# Altium schematic sheet bolid-inputs-hv.SchDoc
size A3
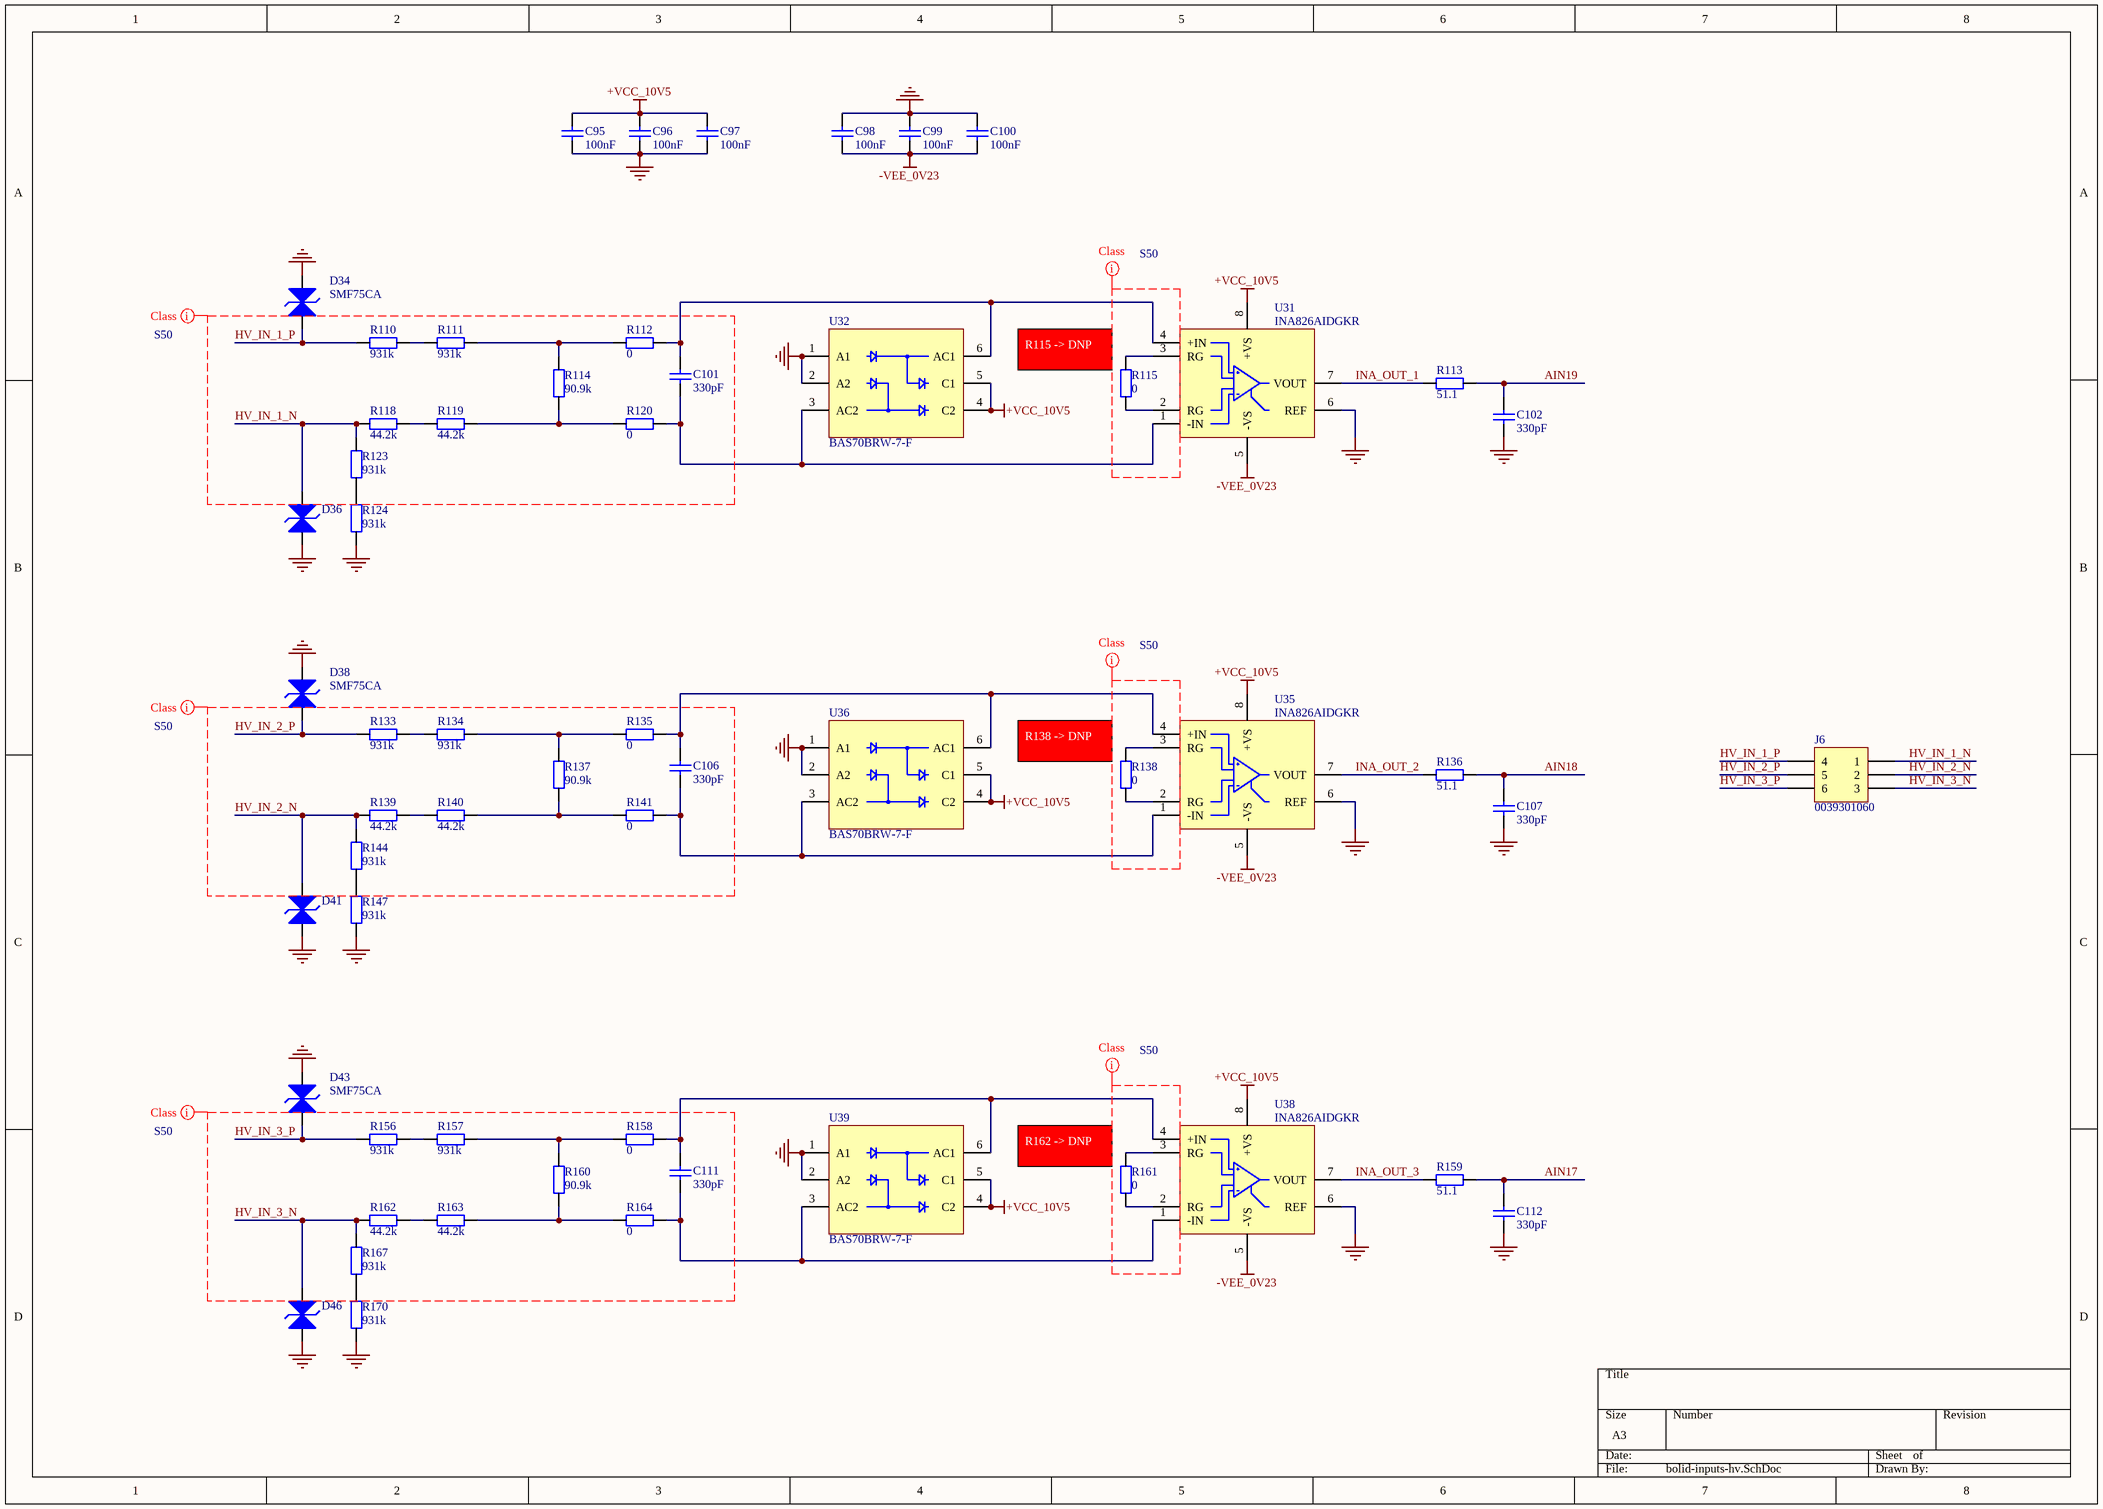
[diagram p0: bolid-inputs-hv.SchDoc]

## Parts
C95  Value Displayed: 100nF  [C0402-CAPC100X50X55L22 - Tayio Yuden TDK]  (hidden comment: GRM155R71H104KE14D)
C96  Value Displayed: 100nF  [C0402-CAPC100X50X55L22 - Tayio Yuden TDK]  (hidden comment: GRM155R71H104KE14D)
C97  Value Displayed: 100nF  [C0402-CAPC100X50X55L22 - Tayio Yuden TDK]  (hidden comment: GRM155R71H104KE14D)
C98  Value Displayed: 100nF  [C0402-CAPC100X50X55L22 - Tayio Yuden TDK]  (hidden comment: GRM155R71H104KE14D)
C99  Value Displayed: 100nF  [C0402-CAPC100X50X55L22 - Tayio Yuden TDK]  (hidden comment: GRM155R71H104KE14D)
C100  Value Displayed: 100nF  [C0402-CAPC100X50X55L22 - Tayio Yuden TDK]  (hidden comment: GRM155R71H104KE14D)
C101  Value Displayed: 330pF  [C0402-CAPC100X50X55L22 - Tayio Yuden TDK]  (hidden comment: C0402C331J5GAC)
C102  Value Displayed: 330pF  [C0402-CAPC100X50X55L22 - Tayio Yuden TDK]  (hidden comment: C0402C331J5GAC)
C106  Value Displayed: 330pF  [C0402-CAPC100X50X55L22 - Tayio Yuden TDK]  (hidden comment: C0402C331J5GAC)
C107  Value Displayed: 330pF  [C0402-CAPC100X50X55L22 - Tayio Yuden TDK]  (hidden comment: C0402C331J5GAC)
C111  Value Displayed: 330pF  [C0402-CAPC100X50X55L22 - Tayio Yuden TDK]  (hidden comment: C0402C331J5GAC)
C112  Value Displayed: 330pF  [C0402-CAPC100X50X55L22 - Tayio Yuden TDK]  (hidden comment: C0402C331J5GAC)
D34  SMF75CA  [SOD-123FL SODFL365X110-2N - BIDIRECTIONAL - Littelfuse]
D36  SMF75CA  [SOD-123FL SODFL365X110-2N - BIDIRECTIONAL - Littelfuse]  (value not drawn)
D38  SMF75CA  [SOD-123FL SODFL365X110-2N - BIDIRECTIONAL - Littelfuse]
D41  SMF75CA  [SOD-123FL SODFL365X110-2N - BIDIRECTIONAL - Littelfuse]  (value not drawn)
D43  SMF75CA  [SOD-123FL SODFL365X110-2N - BIDIRECTIONAL - Littelfuse]
D46  SMF75CA  [SOD-123FL SODFL365X110-2N - BIDIRECTIONAL - Littelfuse]  (value not drawn)
J6  0039301060  [MOLEX Mini-Fit Jr 039301060 2x3 PEG]
R110  value 931k  [R0603-RESC160X80X55L30N]  (hidden comment: RC0603FR-07931KL)
R111  value 931k  [R0603-RESC160X80X55L30N]  (hidden comment: RC0603FR-07931KL)
R112  value 0  [R0402-RESC100X50X40L22N]  (hidden comment: RC0402JR-7D0RL)
R113  value 51.1  [R0402-RESC100X50X40L22N]  (hidden comment: AC0402FR-0751R1L)
R114  value 90.9k  [R0402-RESC100X50X40L22N]  (hidden comment: RC0402FR-0790K9L)
R115  value 0  [R0402-RESC100X50X40L22N]  (hidden comment: RC0402JR-7D0RL)
R118  value 44.2k  [R0603-RESC160X80X55L30N]  (hidden comment: RC0603FR-0744K2L)
R119  value 44.2k  [R0603-RESC160X80X55L30N]  (hidden comment: RC0603FR-0744K2L)
R120  value 0  [R0402-RESC100X50X40L22N]  (hidden comment: RC0402JR-7D0RL)
R123  value 931k  [R0603-RESC160X80X55L30N]  (hidden comment: RC0603FR-07931KL)
R124  value 931k  [R0603-RESC160X80X55L30N]  (hidden comment: RC0603FR-07931KL)
R133  value 931k  [R0603-RESC160X80X55L30N]  (hidden comment: RC0603FR-07931KL)
R134  value 931k  [R0603-RESC160X80X55L30N]  (hidden comment: RC0603FR-07931KL)
R135  value 0  [R0402-RESC100X50X40L22N]  (hidden comment: RC0402JR-7D0RL)
R136  value 51.1  [R0402-RESC100X50X40L22N]  (hidden comment: AC0402FR-0751R1L)
R137  value 90.9k  [R0402-RESC100X50X40L22N]  (hidden comment: RC0402FR-0790K9L)
R138  value 0  [R0402-RESC100X50X40L22N]  (hidden comment: RC0402JR-7D0RL)
R139  value 44.2k  [R0603-RESC160X80X55L30N]  (hidden comment: RC0603FR-0744K2L)
R140  value 44.2k  [R0603-RESC160X80X55L30N]  (hidden comment: RC0603FR-0744K2L)
R141  value 0  [R0402-RESC100X50X40L22N]  (hidden comment: RC0402JR-7D0RL)
R144  value 931k  [R0603-RESC160X80X55L30N]  (hidden comment: RC0603FR-07931KL)
R147  value 931k  [R0603-RESC160X80X55L30N]  (hidden comment: RC0603FR-07931KL)
R156  value 931k  [R0603-RESC160X80X55L30N]  (hidden comment: RC0603FR-07931KL)
R157  value 931k  [R0603-RESC160X80X55L30N]  (hidden comment: RC0603FR-07931KL)
R158  value 0  [R0402-RESC100X50X40L22N]  (hidden comment: RC0402JR-7D0RL)
R159  value 51.1  [R0402-RESC100X50X40L22N]  (hidden comment: AC0402FR-0751R1L)
R160  value 90.9k  [R0402-RESC100X50X40L22N]  (hidden comment: RC0402FR-0790K9L)
R161  value 0  [R0402-RESC100X50X40L22N]  (hidden comment: RC0402JR-7D0RL)
R162  value 44.2k  [R0603-RESC160X80X55L30N]  (hidden comment: RC0603FR-0744K2L)
R163  value 44.2k  [R0603-RESC160X80X55L30N]  (hidden comment: RC0603FR-0744K2L)
R164  value 0  [R0402-RESC100X50X40L22N]  (hidden comment: RC0402JR-7D0RL)
R167  value 931k  [R0603-RESC160X80X55L30N]  (hidden comment: RC0603FR-07931KL)
R170  value 931k  [R0603-RESC160X80X55L30N]  (hidden comment: RC0603FR-07931KL)
U31  INA826AIDGKR  [TI VSSOP8 DGK0008A TSOP65P490X110-8N]
U32  BAS70BRW-7-F  [SOT363 DIODES DS30158 Rev. 14-2 SOT65P210X110-6N]
U35  INA826AIDGKR  [TI VSSOP8 DGK0008A TSOP65P490X110-8N]
U36  BAS70BRW-7-F  [SOT363 DIODES DS30158 Rev. 14-2 SOT65P210X110-6N]
U38  INA826AIDGKR  [TI VSSOP8 DGK0008A TSOP65P490X110-8N]
U39  BAS70BRW-7-F  [SOT363 DIODES DS30158 Rev. 14-2 SOT65P210X110-6N]

## Nets
+VCC_10V5: C95.2 C96.2 C97.2 U31.8(+VS) U32.4(C2) U32.5(C1) U35.8(+VS) U36.4(C2) U36.5(C1) U38.8(+VS) U39.4(C2) U39.5(C1)
-VEE_0V23: C98.1 C99.1 C100.1 U31.5(-VS) U35.5(-VS) U38.5(-VS)
GND: C95.1 C96.1 C97.1 C98.2 C99.2 C100.2 C102.1 C107.1 C112.1 D34.2 D36.1 D38.2 D41.1 D43.2 D46.1 R124.1 R147.1 R170.1 U31.6(REF) U32.1(A1) U32.2(A2) U35.6(REF) U36.1(A1) U36.2(A2) U38.6(REF) U39.1(A1) U39.2(A2)
AIN17: C112.2 R159.2
AIN18: C107.2 R136.2
AIN19: C102.2 R113.2
HV_IN_1_N: D36.2 J6.1 R118.1 R123.2
HV_IN_1_P: D34.1 J6.4 R110.1
HV_IN_2_N: D41.2 J6.2 R139.1 R144.2
HV_IN_2_P: D38.1 J6.5 R133.1
HV_IN_3_N: D46.2 J6.3 R162.1 R167.2
HV_IN_3_P: D43.1 J6.6 R156.1
INA_OUT_1: R113.1 U31.7(VOUT)
INA_OUT_2: R136.1 U35.7(VOUT)
INA_OUT_3: R159.1 U38.7(VOUT)
NetC101_1: C101.1 R120.1 U31.1(-IN) U32.3(AC2)
NetC101_2: C101.2 R112.1 U31.4(+IN) U32.6(AC1)
NetC106_1: C106.1 R141.1 U35.1(-IN) U36.3(AC2)
NetC106_2: C106.2 R135.1 U35.4(+IN) U36.6(AC1)
NetC111_1: C111.1 R164.1 U38.1(-IN) U39.3(AC2)
NetC111_2: C111.2 R158.1 U38.4(+IN) U39.6(AC1)
NetR110_2: R110.2 R111.1
NetR111_2: R111.2 R112.2 R114.2
NetR114_1: R114.1 R119.2 R120.2
NetR115_1: R115.1 U31.2(RG)
NetR115_2: R115.2 U31.3(RG)
NetR118_2: R118.2 R119.1
NetR123_1: R123.1 R124.2
NetR133_2: R133.2 R134.1
NetR134_2: R134.2 R135.2 R137.2
NetR137_1: R137.1 R140.2 R141.2
NetR138_1: R138.1 U35.2(RG)
NetR138_2: R138.2 U35.3(RG)
NetR139_2: R139.2 R140.1
NetR144_1: R144.1 R147.2
NetR156_2: R156.2 R157.1
NetR157_2: R157.2 R158.2 R160.2
NetR160_1: R160.1 R163.2 R164.2
NetR161_1: R161.1 U38.2(RG)
NetR161_2: R161.2 U38.3(RG)
NetR162_2: R162.2 R163.1
NetR167_1: R167.1 R170.2

## Layout directives
net class S50: (no net found under the mark), HV_IN_1_N, HV_IN_1_P, HV_IN_2_N, HV_IN_2_P, HV_IN_3_N, HV_IN_3_P

## Notes on the sheet
- (near R115) R115 -> DNP
- (near R138) R138 -> DNP
- (near R161) R162 -> DNP

## Library data of the parts
C95-C100 = GRM155R71H104KE14D: MLCC 0402 (1005) 100nF 10% 50V X7R; Manufacturer: Murata Electronics; Capacitance: 0.1 uF; Type: Chip Multilayer Ceramic Capacitor for General Purpose; Voltage Rating DC: 50 VDC; Capacitance - pF: 100000 pF; Class: Class 2; Supplier 1: Mouser; Manufacturer Part Number: GRM155R71H104KE14D; RoHS: RoHS Compliant; Category: Multilayer Ceramic Capacitors MLCC - SMD/SMT; Stock 1: 3511637; Pricing 1: 1=0.090, 10=0.038, 100=0.016, 500=0.012, 1000=0.009, 2500=0.008, 5000=0.007, 10000=0.005 (EUR); Height: 0.5 mm; Length: 1 mm; Package / Case: 0402 (1005 metric); Packaging: Cut Tape; Product: General Type MLCCs; Series: GRM; Termination Style: SMD/SMT; Tolerance: 10 %; Width: 0.5 mm; Brand: Murata Electronics; Capacitance - nF: 100 nF; Case Code - in: 0402; Case Code - mm: 1005; Dielectric: X7R; Maximum Operating Temperature: + 125 C; Minimum Operating Temperature: - 55 C; Product Type: Ceramic Capacitors; Standard Pack Qty: 10000; Subcategory: Capacitors; Termination: Standard; RoHS - Mouser: Y; Minimum Order Quantity: 1; Reeling: True; ComponentLink1URL: https://www.mouser.com/datasheet/2/281/murata_03052018_GRM_Series_1-1310166.pdf; ComponentLink1Description: https://www.mouser.com/datasheet/2/281/murata_03052018_GRM_Series_1-1310166.pdf; Value: 100nF; Supplier Part Number 1: 81-GRM155R71H104KE4D
C101 C102 C106 C107 C111 C112 = C0402C331J5GAC: MLCC 0402 (1005) 330pF 5% 50V C0G (N0P); Manufacturer: KEMET; Dielectric Material: Ceramic; Dissipation Factor: 0.1%; Value: 330p; Supplier 1: Mouser; Manufacturer Part Number: C0402C331J5GAC; RoHS: Yes; Category: Ceramic Capacitors; Stock 1: 30000; Pricing 1: 10000=0,08600 (USD); Case/Package: 0402; Case Code (Imperial): 0402; Case Code (Metric): 1005; Min Operating Temperature: -55°C; Max Operating Temperature: 125°C; Capacitance: 330pF; Voltage Rating (DC): 50V; Tolerance: 5%; Package Quantity: 10000; Voltage Rating: 50V; Packaging: Tape and Reel; Dielectric: C0G; Termination: SMD/SMT; Series: C0402C; Length: 1mm; Width: 0.5mm; Height: 0.5mm; Lead Free: Lead Free; RoHS Compliant: Yes; ComponentLink1URL: https://datasheet.ciiva.com/13387/kem-c1003-c0g-smd-356956-13387134.pdf?src-supplier=Mouser; ComponentLink1Description: https://datasheet.ciiva.com/13387/kem-c1003-c0g-smd-356956-13387134.pdf?src-supplier=Mouser; Supplier Part Number 1: 80-C0402C331J5GAC
D34 D36 D38 D41 D43 D46 = SMF75CA: Manufacturer: Littelfuse; Supplier 1: Mouser; Manufacturer Part Number: SMF75CA; RoHS: Yes; Stock 1: 3903; Pricing 1: 1=0,4, 10=0,271, 50=0,271, 100=0,134, 1000=0,121, 10000=0,098 (USD); Supplier Part Number 1: 576-SMF75CA
J6 = 039301060: Molex MiniFit Jr 2x3 Peg Rt Angle Header Tin Plate W/pcb Mount Peg 94V-2 6 Circuit | Molex Incorporated 39-30-1060; Supplier 1: Mouser; Manufacturer: Molex; Manufacturer Part Number: 0039301060; RoHS: Yes; Stock 1: 11572; Pricing 1: 1=0,89, 10=0,554, 50=0,554, 100=0,482, 1000=0,481, 10000=0,463 (USD); Supplier Part Number 1: 538-39-30-1060
R110 R111 R123 R124 R133 R134 R144 R147 R156 R157 R167 R170 = RC0603FR-07931KL: RES 0603 (1608) 931.0k 1% 0.100W 50V Thick Film; Manufacturer: Yageo; Supplier 1: Mouser; Manufacturer Part Number: RC0603FR-07931KL; RoHS: Yes; Category: Chip SMD Resistors; Stock 1: 15576; Pricing 1: 1=0,1, 10=0,01, 50=0,01, 100=0,007, 1000=0,005, 10000=0,004 (USD); Voltage Rating (DC): 50V; Lead Free: 5697LeadFree; ComponentLink1URL: https://datasheet.ciiva.com/2454/pyu-r-int-thick-7-2454555.pdf?src-supplier=Digikey; ComponentLink1Description: https://datasheet.ciiva.com/2454/pyu-r-int-thick-7-2454555.pdf?src-supplier=Digikey; ComponentLink2URL: https://datasheet.ciiva.com/2454/pyu-r-int-thick-7-2454556.pdf?src-supplier=Digikey; ComponentLink2Description: https://datasheet.ciiva.com/2454/pyu-r-int-thick-7-2454556.pdf?src-supplier=Digikey; ComponentLink3URL: https://datasheet.ciiva.com/2454/pyu-r-int-thick-7-2454557.pdf?src-supplier=Digikey; ComponentLink3Description: https://datasheet.ciiva.com/2454/pyu-r-int-thick-7-2454557.pdf?src-supplier=Digikey; ComponentLink4URL: https://datasheet.ciiva.com/12575/rc0603-272842-12575067.pdf?src-supplier=Mouser; ComponentLink4Description: https://datasheet.ciiva.com/12575/rc0603-272842-12575067.pdf?src-supplier=Mouser; Supplier Part Number 1: 603-RC0603FR-07931KL
R112 R115 R120 R135 R138 R141 R158 R161 R164 = RC0402JR-7D0RL: RES 0402 (1005) 0.00 ohm 1% 0.0625W 50V Thick Film; Manufacturer: Yageo; Resistance: 0mR; Tolerance: 5%; Supplier 1: Mouser; Manufacturer Part Number: RC0402JR-7D0RL; RoHS: Yes; Category: Chip SMD Resistors; Stock 1: 114874; Pricing 1: 1=0,10000, 10=0,01400, 50=0,01400, 100=0,00600, 1000=0,00300, 10000=0,00200 (USD); Case/Package: 0402; RoHS Compliant: Yes; Supplier Part Number 1: 603-RC0402JR-7D0RL
R113 R136 R159 = AC0402FR-0751R1L: RES 0402 (1005) 51.1 ohm 1% 0.0625W 50V Thick Film; Manufacturer: Yageo; Power Rating: 62.5mW; Resistance: 51.1R; Max Power Dissipation: 63mW; Temperature Coefficient: 100ppm/°C; Supplier 1: Mouser; Manufacturer Part Number: AC0402FR-0751R1L; RoHS: Yes; Category: Chip SMD Resistors; Stock 1: 57995; Pricing 1: 1=0,10000, 10=0,01500, 50=0,01500, 100=0,00700, 1000=0,00300, 10000=0,00200 (USD); Case/Package: 0402; Case Code (Imperial): 0402; Case Code (Metric): 1005; Min Operating Temperature: -55°C; Max Operating Temperature: 155°C; Packaging: Tape and Reel; Tolerance: 1%; Voltage Rating: 50V; Resistor Type: Thick Film; Number of Terminations: 2; Termination: SMD/SMT; Features: Moisture Resistant,Automotive AEC-Q200; Series: AC; Length: 0.039inch; Width: 0.02inch; Height: 0.015inch; RoHS Compliant: Yes; ComponentLink1URL: http://www.mouser.com/ds/2/447/yageodocoutput-1111992.pdf?src-supplier=Mouser; ComponentLink1Description: http://www.mouser.com/ds/2/447/yageodocoutput-1111992.pdf?src-supplier=Mouser; ComponentLink2URL: http://www.yageo.com/NewPortal/yageodocoutput?fileName=/pdf/R-Chip/PYu-AC_51_RoHS_L_6.pdf&src-supplier=Digi-Key; ComponentLink2Description: http://www.yageo.com/NewPortal/yageodocoutput?fileName=/pdf/R-Chip/PYu-AC_51_RoHS_L_6.pdf&src-supplier=Digi-Key; Supplier Part Number 1: 603-AC0402FR-0751R1L
R114 R137 R160 = RC0402FR-0790K9L: RES 0402 (1005) 90.9k 1% 0.0625W 50V Thick Film; Manufacturer: YAGEO; Power Rating: 62.5 mW (1/16 W); Resistance: 90.9 kOhms; Temperature Coefficient: 100 PPM / C; Supplier 1: Mouser; Manufacturer Part Number: RC0402FR-0790K9L; RoHS: RoHS Compliant By Exemption; Category: Thick Film Resistors - SMD; Stock 1: 41956; Pricing 1: 1=0.088, 10=0.014, 100=0.006, 1000=0.003, 10000=0.001 (EUR); Application: High Reliability; Features: -; Height: 0.35 mm; Length: 1 mm; Packaging: Cut Tape; Product: Thick Film Resistors SMD; Series: RC; Technology: Thick Film; Termination Style: SMD/SMT; Tolerance: 1 %; Type: General Purpose; Voltage Rating: 50 V; Width: 0.5 mm; Brand: YAGEO; Mounting Style: PCB Mount; Case Code - in: 0402; Case Code - mm: 1005; Maximum Operating Temperature: + 155 C; Minimum Operating Temperature: - 55 C; Product Type: Thick Film Resistors; Standard Pack Qty: 10000; Subcategory: Resistors; RoHS - Mouser: E; Minimum Order Quantity: 1; Reeling: True; ComponentLink1URL: https://www.mouser.com/datasheet/2/447/PYu_RC_Group_51_RoHS_L_10-1664068.pdf; ComponentLink1Description: https://www.mouser.com/datasheet/2/447/PYu_RC_Group_51_RoHS_L_10-1664068.pdf; Supplier Part Number 1: 603-RC0402FR-0790K9L
R118 R119 R139 R140 R162 R163 = RC0603FR-0744K2L: RES 0603 (1608) 44.2k 1% 0.100W 50V Thick Film; Manufacturer: Yageo; Supplier 1: Mouser; Manufacturer Part Number: RC0603FR-0744K2L; RoHS: Yes; Category: Chip SMD Resistors; Stock 1: 19002; Pricing 1: 1=0,1, 10=0,012, 50=0,012, 100=0,007, 1000=0,005, 10000=0,003 (USD); Voltage Rating (DC): 50V; Lead Free: 5697LeadFree; ComponentLink1URL: https://datasheet.ciiva.com/11819/0900766b80f96399-11819371.pdf?src-supplier=Rs; ComponentLink1Description: https://datasheet.ciiva.com/11819/0900766b80f96399-11819371.pdf?src-supplier=Rs; ComponentLink2URL: https://datasheet.ciiva.com/2455/pyu-r-int-thick-7-2455152.pdf?src-supplier=Digikey; ComponentLink2Description: https://datasheet.ciiva.com/2455/pyu-r-int-thick-7-2455152.pdf?src-supplier=Digikey; ComponentLink3URL: https://datasheet.ciiva.com/2455/pyu-r-int-thick-7-2455153.pdf?src-supplier=Digikey; ComponentLink3Description: https://datasheet.ciiva.com/2455/pyu-r-int-thick-7-2455153.pdf?src-supplier=Digikey; ComponentLink4URL: https://datasheet.ciiva.com/2455/pyu-r-int-thick-7-2455154.pdf?src-supplier=Digikey; ComponentLink4Description: https://datasheet.ciiva.com/2455/pyu-r-int-thick-7-2455154.pdf?src-supplier=Digikey; Supplier Part Number 1: 603-RC0603FR-0744K2L
U31 U35 U38 = INA826AIDGKR: Precision, 200-μA Supply Current, 36-V Supply Instrumentation Amplifier 8-VSSOP -40 to 125; Manufacturer: Texas Instruments; Resistance: 100kR; Supplier 1: Mouser; Manufacturer Part Number: INA826AIDGKR; RoHS: Yes; Category: Amplifiers - Op Amps, Buffer, Instrumentation; Stock 1: 18608; Pricing 1: 1=2,95, 10=2,03, 50=2,03, 100=1,79, 1000=1,52, 10000=1,4 (USD); Length: 3mm; Width: 3mm; Height: 1.07mm; Thickness: 970um; ComponentLink1URL: https://datasheet.ciiva.com/1798/ina826-1798294.pdf?src-supplier=Digikey; ComponentLink1Description: https://datasheet.ciiva.com/1798/ina826-1798294.pdf?src-supplier=Digikey; ComponentLink2URL: https://datasheet.ciiva.com/1798/ina826-1798295.pdf?src-supplier=Digikey; ComponentLink2Description: https://datasheet.ciiva.com/1798/ina826-1798295.pdf?src-supplier=Digikey; ComponentLink3URL: https://datasheet.ciiva.com/1798/ina826-1798296.pdf?src-supplier=Digikey; ComponentLink3Description: https://datasheet.ciiva.com/1798/ina826-1798296.pdf?src-supplier=Digikey; ComponentLink4URL: https://datasheet.ciiva.com/14338/ina826-14338024.pdf?src-supplier=Avnet; ComponentLink4Description: https://datasheet.ciiva.com/14338/ina826-14338024.pdf?src-supplier=Avnet; ComponentLink5URL: https://datasheet.ciiva.com/1487/1806064-1487618.pdf?src-supplier=Element14; ComponentLink5Description: https://datasheet.ciiva.com/1487/1806064-1487618.pdf?src-supplier=Element14; Supplier Part Number 1: 595-INA826AIDGKR
U32 U36 U39 = BAS70BRW-7-F: BAS70BRW Series 70 V 100 mA Surface Mount Schottky Barrier Diode Arrays SOT-363; Manufacturer: Diodes; Forward Current: 70mA; Max Reverse Current: 100nA; Forward Voltage: 1V; Max Power Dissipation: 200mW; Reverse Recovery Time: 5ns; Max Repetitive Reverse Voltage (Vrrm): 70V; Peak Non-Repetitive Surge Current: 100mA; Capacitance: 2pF; Supplier 1: Mouser; Manufacturer Part Number: BAS70BRW-7-F; RoHS: Yes; Category: Schottky Diodes; Stock 1: 23365; Pricing 1: 1=0,62000, 10=0,53000, 50=0,53000, 100=0,39600, 1000=0,24100, 10000=0,19700 (USD); Mount: Surface Mount; Case/Package: SOT-363; Number of Pins: 6; Weight: 0.000212oz; Contact Plating: Tin,Matte; Min Operating Temperature: -55°C; Max Operating Temperature: 125°C; Package Quantity: 3000; Packaging: Tape and Reel; Average Rectified Current: 70mA; Power Dissipation: 200mW; Termination: SMD/SMT; Max Forward Surge Current (Ifsm): 100mA; Current Rating: 70mA; Power Rating: 200mW; Voltage Rating (DC): 70V; Max Reverse Voltage (DC): 70V; Series: -; Length: 2.2mm; Width: 1.35mm; Height: 1mm; Radiation Hardening: No; Lead Free: Lead Free; RoHS Compliant: Yes; ComponentLink1URL: https://datasheet.ciiva.com/26949/getdatasheetpartid-202320-26949402.pdf?src-supplier=Verical; ComponentLink1Description: https://datasheet.ciiva.com/26949/getdatasheetpartid-202320-26949402.pdf?src-supplier=Verical; Supplier Part Number 1: 621-BAS70BRW-7-F